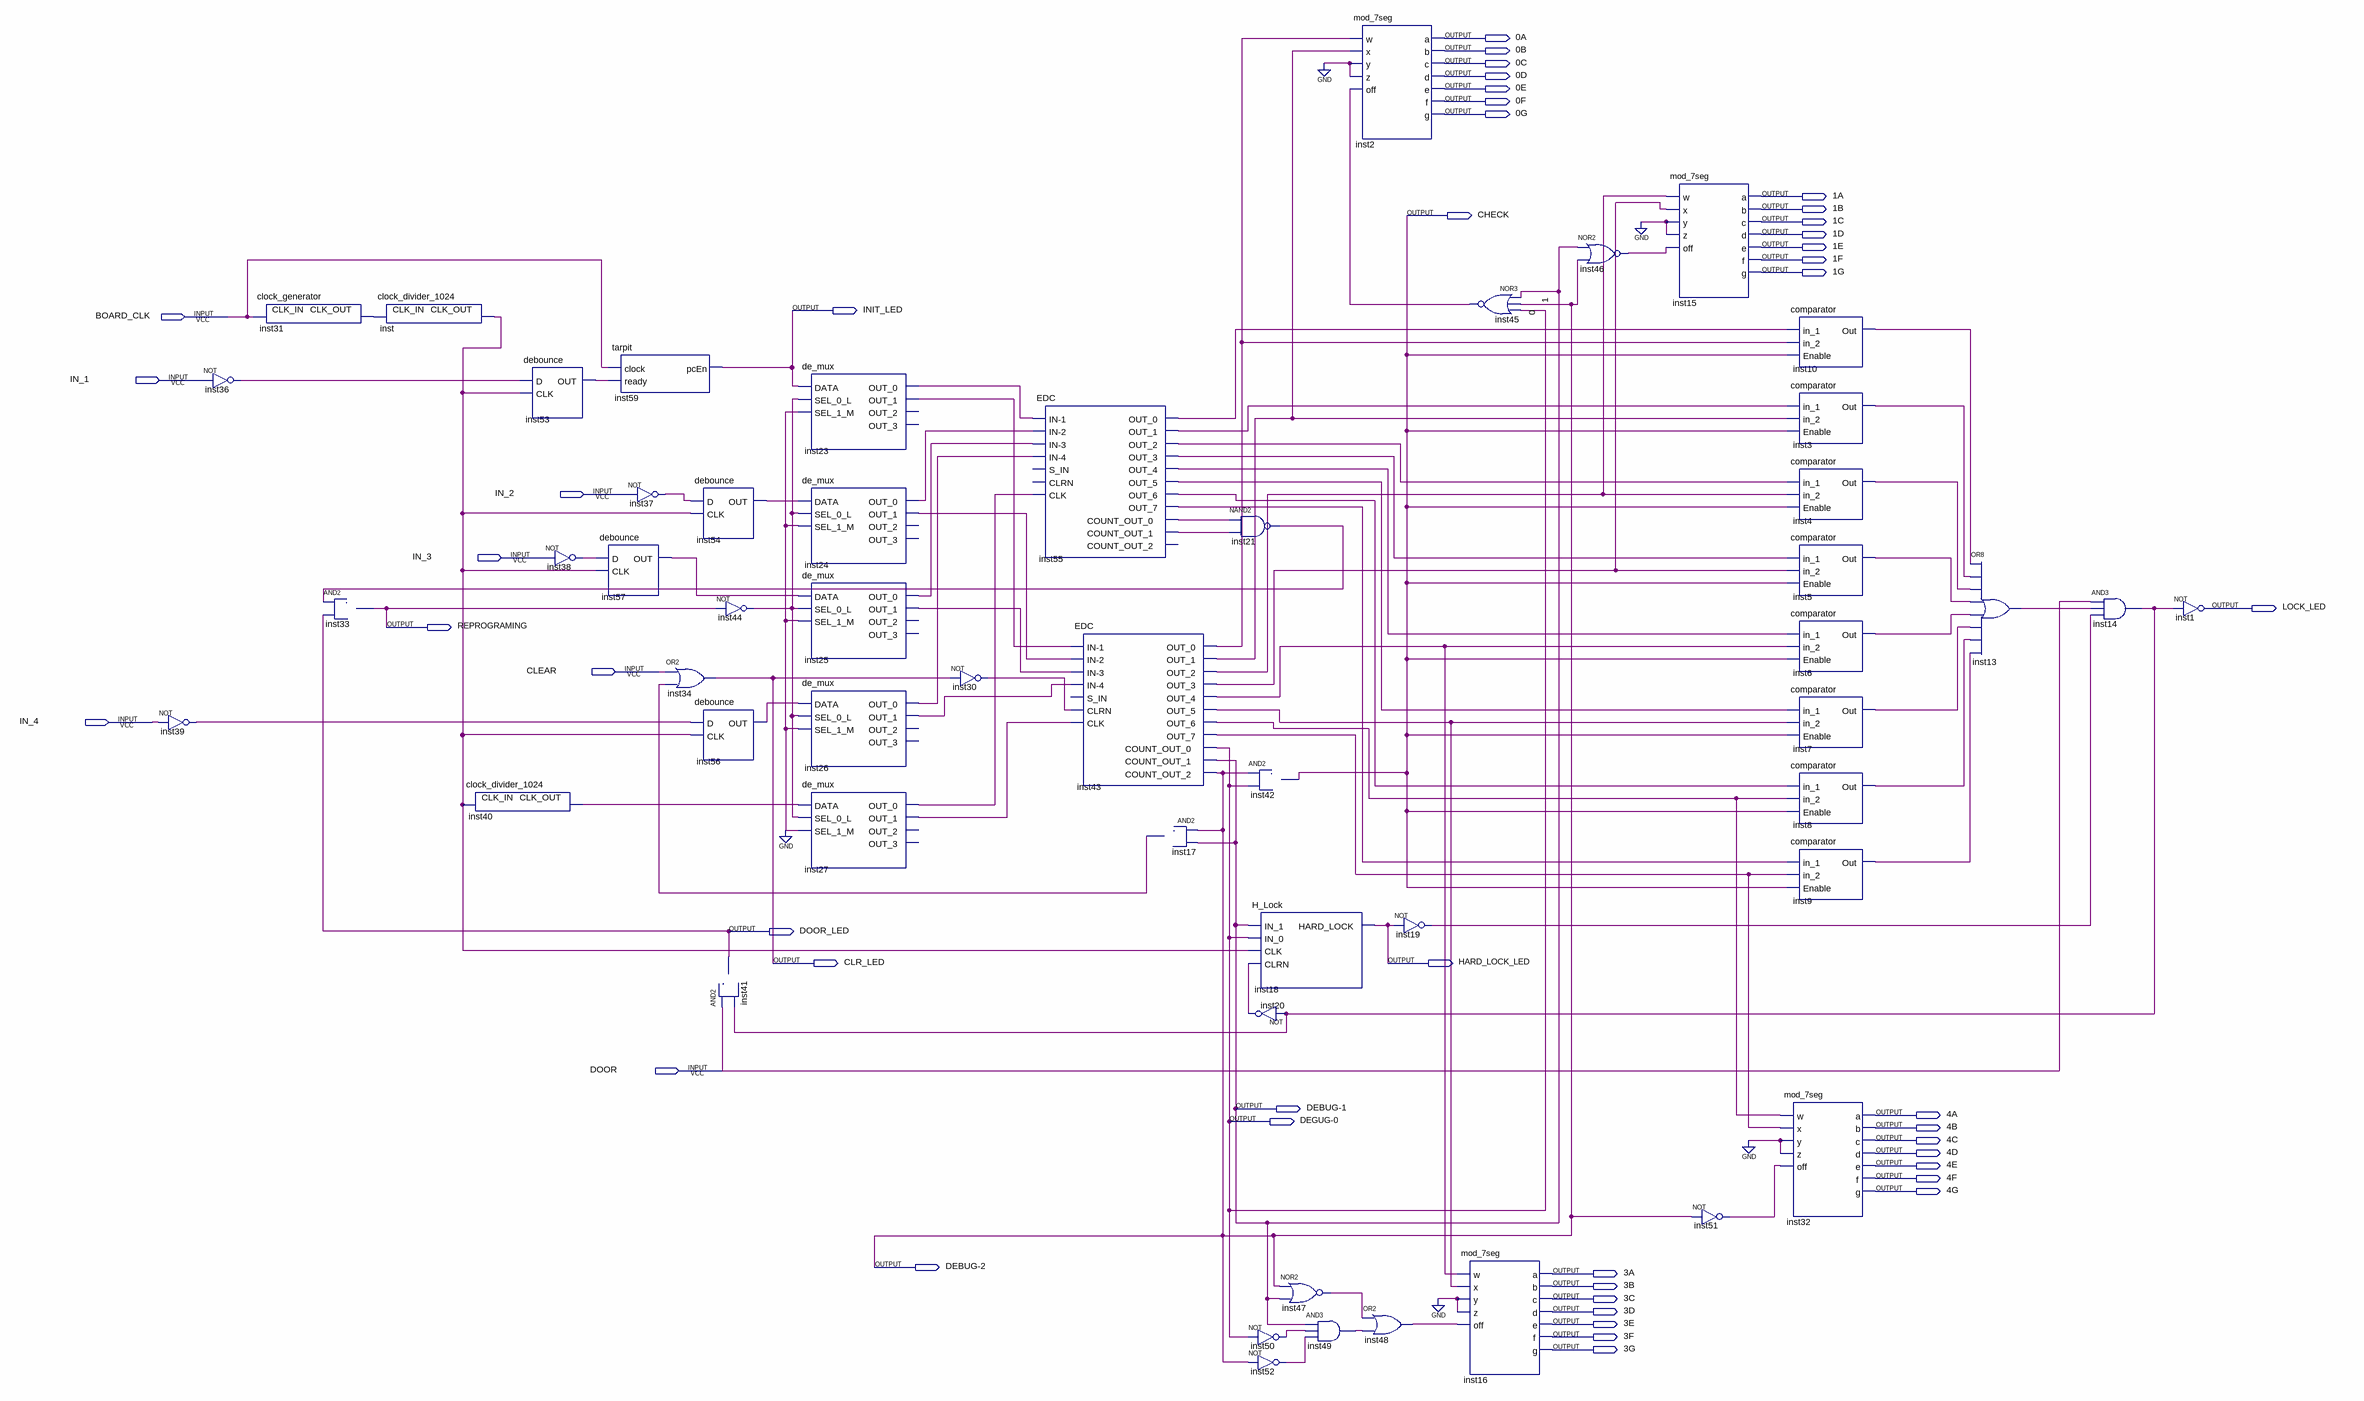
[diagram p0: schematic sheet]
// Quartus schematic FINAL.bdf as structural Verilog: 53 symbols, 45 pins
module FINAL (
  input  BOARD_CLK,
  input  IN_1,
  input  IN_2,
  input  IN_3,
  input  CLEAR,
  input  IN_4,
  input  DOOR,
  output \0A ,
  output \0B ,
  output \0C ,
  output \0D ,
  output \0E ,
  output \0F ,
  output \0G ,
  output \1A ,
  output \1B ,
  output CHECK,
  output \1C ,
  output \1D ,
  output \1E ,
  output \1F ,
  output \1G ,
  output INIT_LED,
  output LOCK_LED,
  output REPROGRAMING,
  output DOOR_LED,
  output CLR_LED,
  output HARD_LOCK_LED,
  output \DEBUG-1 ,
  output \4A ,
  output \DEGUG-0 ,
  output \4B ,
  output \4C ,
  output \4D ,
  output \4E ,
  output \4F ,
  output \4G ,
  output \DEBUG-2 ,
  output \3A ,
  output \3B ,
  output \3C ,
  output \3D ,
  output \3E ,
  output \3F ,
  output \3G 
);

  wire inst3_out, inst4_out, inst5_out, inst6_out, inst7_out, inst8_out, inst9_out, inst10_out, inst13_out,
       inst14_out, inst17_out, inst19_out, inst20_out, inst21_out, inst23_out_0, inst23_out_1, inst24_out_0,
       inst24_out_1, inst25_out_0, inst25_out_1, inst26_out_0, inst26_out_1, inst27_out_0, inst27_out_1,
       inst30_out, inst31_clk_out, inst36_out, inst37_out, inst38_out, inst39_out, inst40_clk_out,
       inst43_out_0, inst43_out_1, inst43_out_2, inst43_out_3, inst43_out_4, inst43_out_5, inst43_out_6,
       inst43_out_7, inst44_out, inst45_out, inst46_out, inst47_out, inst48_out, inst49_out, inst50_out,
       inst51_out, inst52_out, inst53_out, inst54_out, inst55_count_out_0, inst55_count_out_1, inst55_out_0,
       inst55_out_1, inst55_out_2, inst55_out_3, inst55_out_4, inst55_out_5, inst55_out_6, inst55_out_7,
       inst56_out, inst57_out, inst_clk_out;

  not inst39 (inst39_out, IN_4);
  not inst36 (inst36_out, IN_1);
  clock_generator inst31 (.CLK_IN(BOARD_CLK), .CLK_OUT(inst31_clk_out));
  and inst33 (REPROGRAMING, inst21_out, DOOR_LED);
  clock_divider_1024 inst (.CLK_IN(inst31_clk_out), .CLK_OUT(inst_clk_out));
  clock_divider_1024 inst40 (.CLK_IN(inst_clk_out), .CLK_OUT(inst40_clk_out));
  debounce inst53 (.D(inst36_out), .CLK(inst_clk_out), .OUT(inst53_out));
  not inst38 (inst38_out, IN_3);
  tarpit inst59 (.clock(BOARD_CLK), .ready(inst53_out), .pcEn(INIT_LED));
  not inst37 (inst37_out, IN_2);
  debounce inst57 (.D(inst38_out), .CLK(inst_clk_out), .OUT(inst57_out));
  or inst34 (CLR_LED, CLEAR, inst17_out);
  debounce inst54 (.D(inst37_out), .CLK(inst_clk_out), .OUT(inst54_out));
  not inst44 (inst44_out, REPROGRAMING);
  debounce inst56 (.D(inst39_out), .CLK(inst_clk_out), .OUT(inst56_out));
  and inst41 (DOOR_LED, DOOR, inst14_out);
  de_mux inst23 (
    .DATA(INIT_LED), .SEL_0_L(inst44_out), .SEL_1_M(1'b0), .OUT_0(inst23_out_0), .OUT_1(inst23_out_1));  // open: OUT_2, OUT_3
  de_mux inst24 (
    .DATA(inst54_out), .SEL_0_L(inst44_out), .SEL_1_M(1'b0), .OUT_0(inst24_out_0), .OUT_1(inst24_out_1));  // open: OUT_2, OUT_3
  de_mux inst25 (
    .DATA(inst57_out), .SEL_0_L(inst44_out), .SEL_1_M(1'b0), .OUT_0(inst25_out_0), .OUT_1(inst25_out_1));  // open: OUT_2, OUT_3
  de_mux inst26 (
    .DATA(inst56_out), .SEL_0_L(inst44_out), .SEL_1_M(1'b0), .OUT_0(inst26_out_0), .OUT_1(inst26_out_1));  // open: OUT_2, OUT_3
  de_mux inst27 (
    .DATA(inst40_clk_out), .SEL_0_L(inst44_out), .SEL_1_M(1'b0), .OUT_0(inst27_out_0), .OUT_1(inst27_out_1));  // open: OUT_2, OUT_3
  not inst30 (inst30_out, CLR_LED);
  EDC inst55 (
    .\IN-1 (inst23_out_0), .\IN-2 (inst24_out_0), .\IN-3 (inst25_out_0), .\IN-4 (inst26_out_0),
    .CLK(inst27_out_0), .OUT_0(inst55_out_0), .OUT_1(inst55_out_1), .OUT_2(inst55_out_2),
    .OUT_3(inst55_out_3), .OUT_4(inst55_out_4), .OUT_5(inst55_out_5), .OUT_6(inst55_out_6),
    .OUT_7(inst55_out_7), .COUNT_OUT_0(inst55_count_out_0), .COUNT_OUT_1(inst55_count_out_1));  // open: S_IN, CLRN, COUNT_OUT_2
  EDC inst43 (
    .\IN-1 (inst23_out_1), .\IN-2 (inst24_out_1), .\IN-3 (inst25_out_1), .\IN-4 (inst26_out_1),
    .CLRN(inst30_out), .CLK(inst27_out_1), .OUT_0(inst43_out_0), .OUT_1(inst43_out_1), .OUT_2(inst43_out_2),
    .OUT_3(inst43_out_3), .OUT_4(inst43_out_4), .OUT_5(inst43_out_5), .OUT_6(inst43_out_6),
    .OUT_7(inst43_out_7), .COUNT_OUT_0(\DEGUG-0 ), .COUNT_OUT_1(\DEBUG-1 ), .COUNT_OUT_2(\DEBUG-2 ));  // open: S_IN
  and inst17 (inst17_out, \DEBUG-2 , \DEBUG-1 );
  nand inst21 (inst21_out, inst55_count_out_0, inst55_count_out_1);
  and inst42 (CHECK, \DEBUG-2 , \DEGUG-0 );
  H_Lock inst18 (.IN_1(\DEBUG-1 ), .IN_0(\DEGUG-0 ), .CLK(inst_clk_out), .CLRN(inst20_out), .HARD_LOCK(HARD_LOCK_LED));
  not inst20 (inst20_out, inst14_out);
  nor inst47 (inst47_out, \DEBUG-2 , \DEBUG-1 );
  not inst50 (inst50_out, \DEGUG-0 );
  not inst52 (inst52_out, \DEBUG-2 );
  and inst49 (inst49_out, \DEBUG-1 , inst50_out, inst52_out);
  mod_7seg inst2 (
    .w(inst43_out_0), .x(inst43_out_1), .y(1'b0), .z(1'b0), .off(inst45_out), .a(\0A ), .b(\0B ), .c(\0C ),
    .d(\0D ), .e(\0E ), .f(\0F ), .g(\0G ));
  or inst48 (inst48_out, inst47_out, inst49_out);
  not inst19 (inst19_out, HARD_LOCK_LED);
  nor inst45 (inst45_out, \DEBUG-1 , \DEBUG-2 , \DEGUG-0 );
  mod_7seg inst16 (
    .w(inst43_out_4), .x(inst43_out_5), .y(1'b0), .z(1'b0), .off(inst48_out), .a(\3A ), .b(\3B ), .c(\3C ),
    .d(\3D ), .e(\3E ), .f(\3F ), .g(\3G ));
  nor inst46 (inst46_out, \DEBUG-1 , \DEBUG-2 );
  mod_7seg inst15 (
    .w(inst43_out_2), .x(inst43_out_3), .y(1'b0), .z(1'b0), .off(inst46_out), .a(\1A ), .b(\1B ), .c(\1C ),
    .d(\1D ), .e(\1E ), .f(\1F ), .g(\1G ));
  not inst51 (inst51_out, \DEBUG-2 );
  comparator inst10 (.in_1(inst55_out_0), .in_2(inst43_out_0), .Enable(CHECK), .Out(inst10_out));
  comparator inst3 (.in_1(inst55_out_1), .in_2(inst43_out_1), .Enable(CHECK), .Out(inst3_out));
  comparator inst4 (.in_1(inst55_out_2), .in_2(inst43_out_2), .Enable(CHECK), .Out(inst4_out));
  comparator inst5 (.in_1(inst55_out_3), .in_2(inst43_out_3), .Enable(CHECK), .Out(inst5_out));
  comparator inst6 (.in_1(inst55_out_4), .in_2(inst43_out_4), .Enable(CHECK), .Out(inst6_out));
  comparator inst7 (.in_1(inst55_out_5), .in_2(inst43_out_5), .Enable(CHECK), .Out(inst7_out));
  comparator inst8 (.in_1(inst55_out_6), .in_2(inst43_out_6), .Enable(CHECK), .Out(inst8_out));
  comparator inst9 (.in_1(inst55_out_7), .in_2(inst43_out_7), .Enable(CHECK), .Out(inst9_out));
  mod_7seg inst32 (
    .w(inst43_out_6), .x(inst43_out_7), .y(1'b0), .z(1'b0), .off(inst51_out), .a(\4A ), .b(\4B ), .c(\4C ),
    .d(\4D ), .e(\4E ), .f(\4F ), .g(\4G ));
  or inst13 (inst13_out, inst10_out, inst3_out, inst4_out, inst5_out, inst6_out, inst7_out, inst8_out, inst9_out);
  and inst14 (inst14_out, DOOR, inst13_out, inst19_out);
  not inst1 (LOCK_LED, inst14_out);

  // Other names for the same wires on the sheet: 1 = \DEBUG-1 ; 0 = \DEGUG-0 
endmodule
